# EasyEDA Pro project 嘉立创专业版_ProDocument_遥控器设计_2024-03-31.epro

# Schematic Schematic1

## Sheets
1 其他: Create Date: 2023-11-18; Page Name: 其他; Project Name: 遥控器设计; Schematic Name: Schematic1; Update Date: 2024-01-14; Company: 嘉立创EDA; Page Size: A4; Version: V1.0
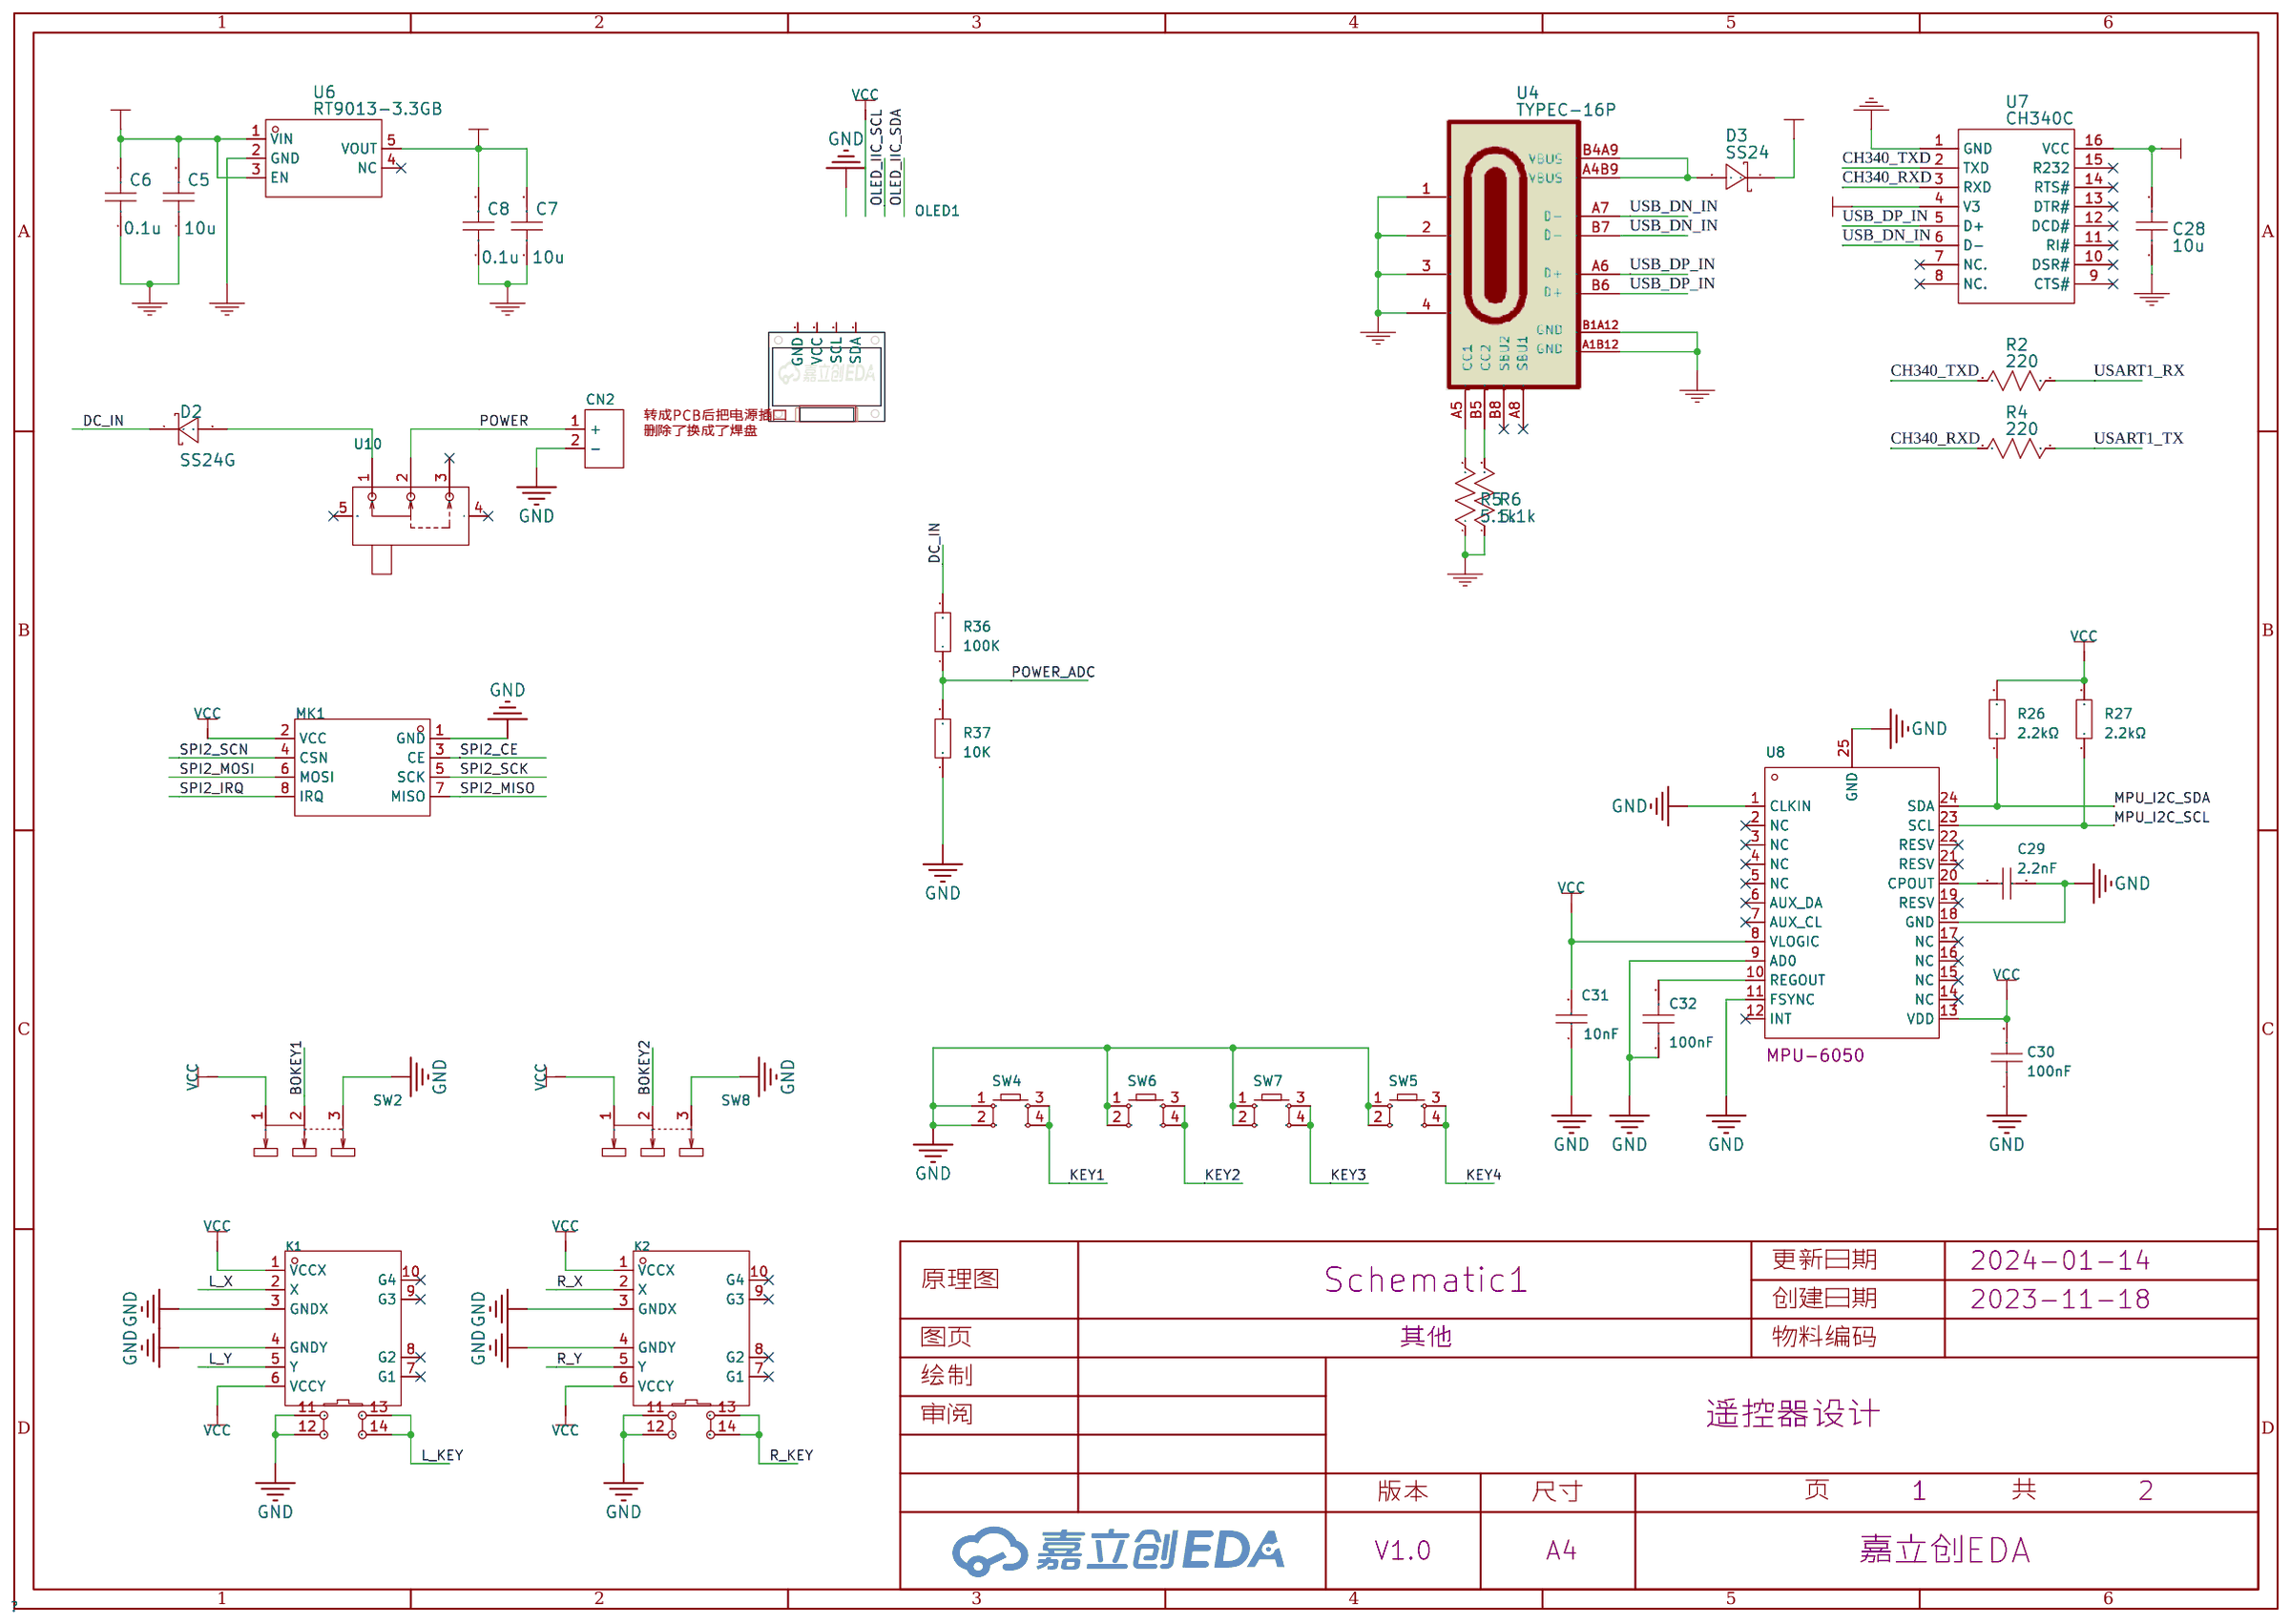
[diagram p0: 其他]
2 stm32最小系统: Page Name: stm32最小系统; Add into BOM: yes; Convert to PCB: yes
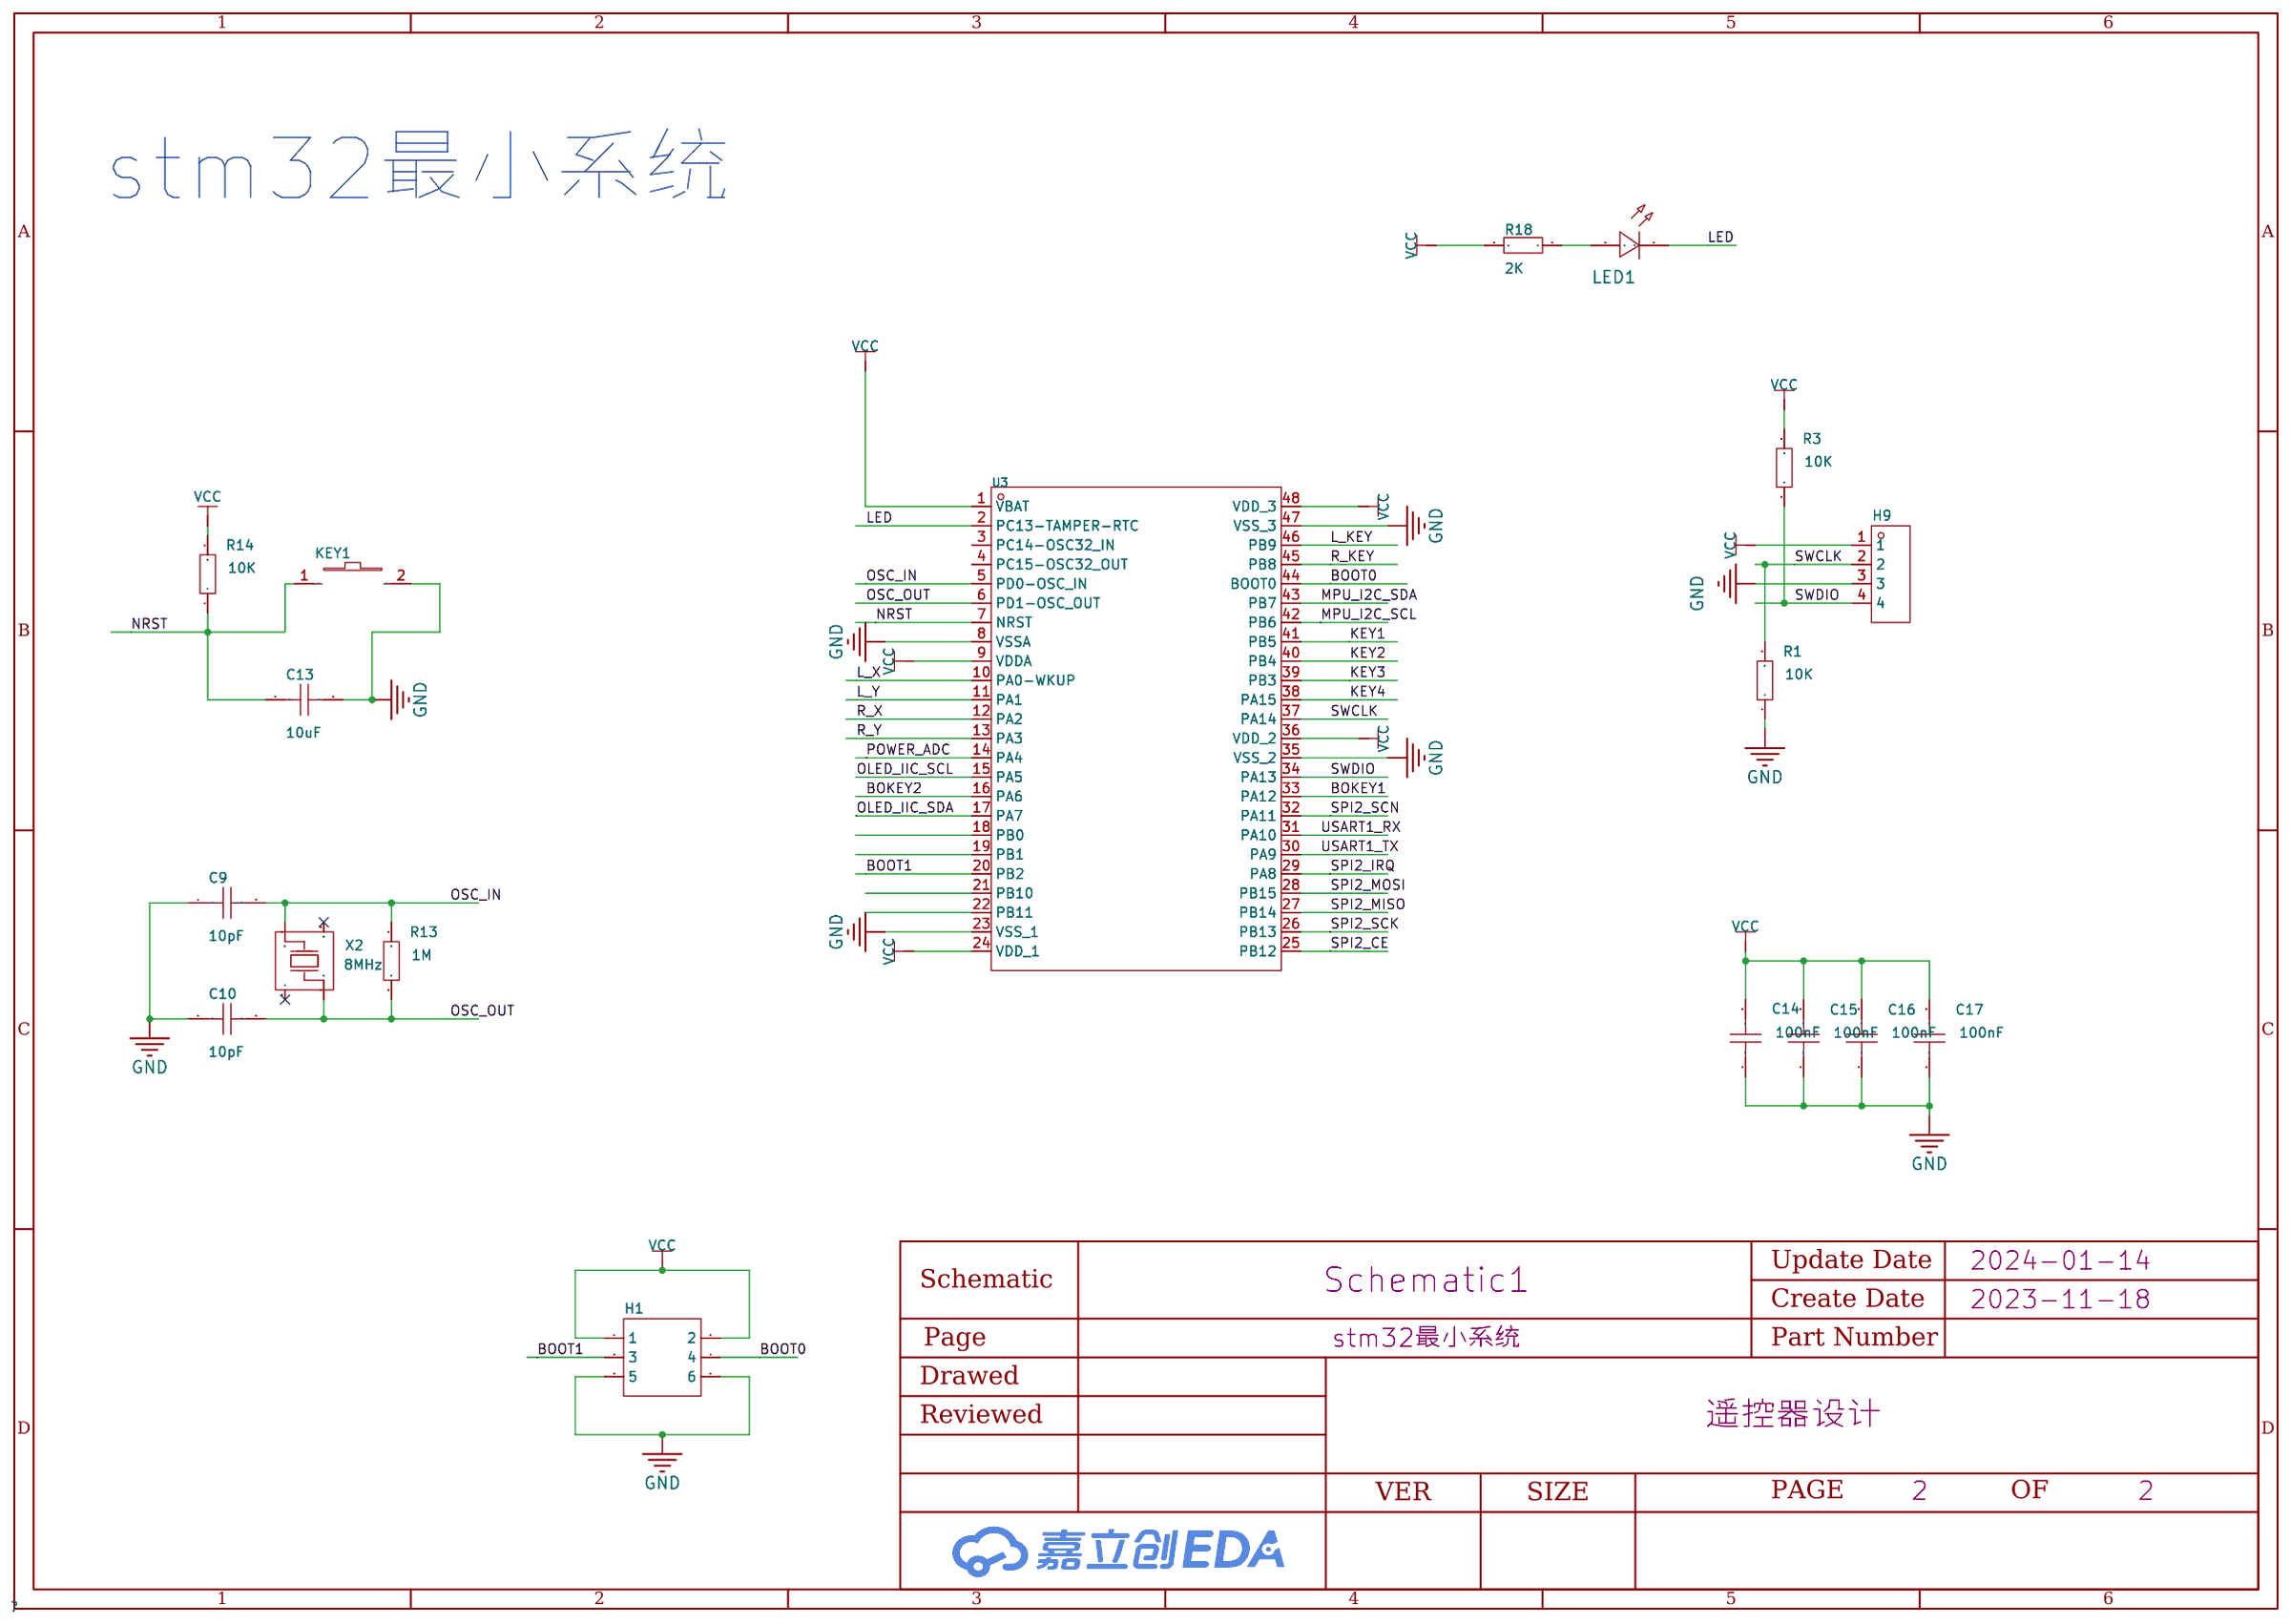
[diagram p1: stm32最小系统]

## Parts
sheet stm32最小系统
C9  10pF  [C0603]
C10  10pF  [C0603]
C13  10uF  [C0603]
C14  100nF  [C0603]
C15  100nF  [C0603]
C16  100nF  [C0603]
C17  100nF  [C0603]
H1  -  [HDR-TH_6P-P2.54-V-F-R2-C3-S2.54]
H9  -  [HDR-TH_4P-P2.54-V-M]
KEY1  轻触开关3x4x2  [SW-SMD_L4.0-W2.9-LS5.0]
LED1  -  [LED0805-RD_RED]
R1  10K  [R0603]
R3  10K  [R0603]
R13  1M  [R0603]
R14  10K  [R0603]
R18  2K  [R0603]
U3  STM32F103C8T6  [LQFP-48_L7.0-W7.0-P0.50-LS9.0-BL]
X2  8MHz  [OSC-SMD_4P-L3.2-W2.5-BL]
sheet 其他
C5  10u  [C0603]
C6  0.1u  [C0603]
C7  10u  [C0603]
C8  0.1u  [C0603]
C28  10u  [C0603]
C29  2.2nF  [C0603]
C30  100nF  [C0603]
C31  10nF  [C0603]
C32  100nF  [C0603]
CN2  XT30UPB-F  [CONN-TH_XT30UPB-F]
D2  SS24G  [SMA_L4.4-W2.8-LS5.4-RD]
D3  SS24  [SMA_L4.3-W2.6-LS5.2-RD]
K1  -  [摇杆按键-16x16-直插]
K2  -  [摇杆按键-16x16-直插]
MK1  NF-04  [WIRELM-SMD_NRF24L01]
OLED1  -  [0.96OLED_4P]
R2  220  [R0603]
R4  220  [R0603]
R5  5.1k  [R0603]
R6  5.1k  [R0603]
R26  2.2kΩ  [R0603]
R27  2.2kΩ  [R0603]
R36  100K  [R0603]
R37  10K  [R0603]
SW2  SS-12D10L5  [SW-TH_SS-12D10L5]
SW4  -  [SW-TH_4P-L6.0-W6.0-P4.50-LS6.5]
SW5  -  [SW-TH_4P-L6.0-W6.0-P4.50-LS6.5]
SW6  -  [SW-TH_4P-L6.0-W6.0-P4.50-LS6.5]
SW7  -  [SW-TH_4P-L6.0-W6.0-P4.50-LS6.5]
SW8  SS-12D10L5  [SW-TH_SS-12D10L5]
U4  TYPEC-16P  [TYPEC]
U6  RT9013-3.3GB  [SOT-23-5_L2.9-W1.6-P0.94-LS2.8-BL]
U7  CH340C  [SOP-16_L10.0-W3.9-P1.27-LS6.0-BL]
U8  -  [QFN-24_L4.0-W4.0-P0.50-BL-EP2.7]
U10  SS-12F23-G4  [SW-TH_SS-12F23-G040]

## Library data of the parts
C9 C10 = CAP_0603: Supplier Footprint: 0603
C13 = C0603: 容值:100nF;精度:±10%;额定电压:50V;材质(温度系数):X7R;; LCSC Part Name: 100nF ±10% 50V; Supplier Part: C14663; Manufacturer: YAGEO(国巨); Manufacturer Part: CC0603KRX7R9BB104; Supplier Footprint: 0603; JLCPCB Part Class: Basic Part; Datasheet: https://atta.szlcsc.com/upload/public/pdf/source/20170116/1484561234239.pdf; Supplier: LCSC; Tolerance: ±10%; Voltage Rated: 50V; Temperature Coefficient: X7R
C14-C17 = CAP_0805: Supplier Footprint: 0805
H1 = HDR-F_2.54_2x3: Supplier Part: C92272; Supplier Footprint: 插件
H9 = HDR-M_2.54_1x4P: Supplier Part: C492403; Supplier Footprint: 插件
KEY1 = 轻触开关3x4x2: 触点电流:50mA;额定电压(DC):12V;电路结构:单刀单掷;安装方式:立贴;按钮形状:圆形按钮;带灯:-;开关长度:4mm;开关宽度:3mm;开关高度:2mm;; LCSC Part Name: 3x4x2  柱高0.5; Supplier Part: C26638; Manufacturer: 国产; Supplier Footprint: SMD; JLCPCB Part Class: 扩展库; Datasheet: https://atta.szlcsc.com/upload/public/pdf/source/20150923/1457707412058.pdf; Supplier: LCSC; Contact Current: 50mA; Voltage Rating (DC): 12V; Circuit: 单刀单掷; Mounting Style: 立贴; Actuator Style: 圆形按钮; Switch Length: 4mm; Switch Width: 3mm; Switch Height: 2mm
LED1 = LED_0805-R: Supplier Footprint: 0805
R1 R3 R13 R14 R18 R36 R37 = Res_0603: Supplier Footprint: 0603
U3 = STM32F103C8T6: CPU内核:ARM Cortex-M3;CPU最大主频:72MHz;工作电压范围:2V~3.6V;内部振荡器:有;程序 FLASH容量:64K@x8bit;RAM总容量:20KB;EEPROM/数据 FLASH容量:-;GPIO端口数量:37;ADC(单元数/通道数/位数):1@x10ch/12bit;外设/功能/协议栈:看门狗；DMA；看门狗；片载温度传感器;工作温度范围:-40℃~+85℃;; LCSC Part Name: ARM Cortex-M3 72MHz 闪存：64K@x8bit RAM：20KB MSL=3; Supplier Part: C8734; Manufacturer: ST(意法半导体); Supplier Footprint: LQFP-48(7x7); JLCPCB Part Class: 扩展库; Supplier: LCSC; CPU Core: ARM Cortex-M3; Maximum Frequency: 72MHz; Supply Voltage Range: 2V~3.6V; Internal Oscillator: 有; Program FLASH Size: 64K@x8bit; RAM Size: 20KB; GPIO Ports Number: 37; ADC (Units/Channels/bits): 1@x10ch/12bit; Peripherals / Functions / Protocol Stacks: 看门狗；DMA；看门狗；片载温度传感器; Operating Temperature Range: -40℃~+85℃
X2 = TAXM8M4RDBCCT2T: 晶振类型:SMD 谐振器;频率:8MHz;频率公差:±10ppm;频率稳定度:±15ppm;负载电容:10pF;等效串联电阻(ESR):250Ω;工作温度:-;; LCSC Part Name: 8MHz ±10ppm 10pF; Supplier Part: C400090; Manufacturer: TAE(雅晶鑫); Supplier Footprint: SMD3225-4P; JLCPCB Part Class: 扩展库; Datasheet: https://atta.szlcsc.com/upload/public/pdf/source/20190626/C400090_CF95B89E745AFE4EF2E392EF8AC009D6.pdf; Supplier: LCSC; Crystal Type: SMD 谐振器; Frequency Tolerance: ±10ppm; Frequency Stability: ±15ppm; Load Capacitance: 10pF; Equivalent Series Resistance (ESR): 250Ω
C5 C7 C28 = 10u
C6 C8 = 0.1u
C29 = 0402B222K500NT: 容值:2.2nF;精度:±10%;额定电压:50V;材质(温度系数):X7R;; LCSC Part Name: 2.2nF ±10% 50V; Supplier Part: C1531; Manufacturer: FH(风华); Supplier Footprint: 0402; JLCPCB Part Class: 基础库; Datasheet: https://atta.szlcsc.com/upload/public/pdf/source/20170923/C1531_1506149258433988338.pdf; Supplier: LCSC; Tolerance: ±10%; Voltage Rated: 50V; Temperature Coefficient: X7R
C30 C32 = CC0402KRX7R7BB104: 容值:100nF;精度:±10%;额定电压:16V;材质(温度系数):X7R;; LCSC Part Name: 100nF ±10% 16V; Supplier Part: C60474; Manufacturer: YAGEO(国巨); Supplier Footprint: 0402; JLCPCB Part Class: 扩展库; Datasheet: https://atta.szlcsc.com/upload/public/pdf/source/20211223/9278FD768280B81DDBEF48FA36411A03.pdf; Supplier: LCSC; Tolerance: ±10%; Voltage Rated: 16V; Temperature Coefficient: X7R
C31 = CC0402KRX7R9BB103: 容值:10nF;精度:±10%;额定电压:50V;温度系数:X7R;; LCSC Part Name: 10nF ±10% 50V; Supplier Part: C60133; Manufacturer: YAGEO(国巨); Supplier Footprint: 0402; JLCPCB Part Class: Extended Part; Datasheet: https://atta.szlcsc.com/upload/public/pdf/source/20151201/1457707601869.pdf; Supplier: LCSC; Tolerance: ±10%; Voltage Rated: 50V; Temperature Coefficient: X7R
CN2 = XT30UPB-F: 模型插头连接器; Supplier Part: C108769; Manufacturer: AMASS(艾迈斯); Supplier Footprint: 间距5mm; JLCPCB Part Class: 扩展库; Datasheet: https://atta.szlcsc.com/upload/public/pdf/source/20180126/C108769_15169557890251308829.pdf; Supplier: LCSC
D2 = SS24G: Supplier: LCSC; Supplier Part: C183481; Manufacturer: SK; JLCPCB Part Class: Extended Part
D3 = SS24: Supplier: LCSC; Manufacturer: MDD; Supplier Part: C50645; JLCPCB Part Class: Extended Part
K1 K2 = 摇杆-按键-16x16-直插
MK1 = NRF24L01: 低成本NF-04台产芯片 功率加强版 最佳通讯距离240米，2.4G无线通讯模块; LCSC Part Name: NF-04 功率加强版 绑定 2.4G无线模块; Supplier Part: C90751; Manufacturer: Ai-Thinker(安信可); Supplier Footprint: 插件; JLCPCB Part Class: 扩展库; Datasheet: https://atta.szlcsc.com/upload/public/pdf/source/20190912/C90751_790912ADD510BE02DBCDD1D692AB4B0B.pdf; Supplier: LCSC
OLED1 = 0.96OLED模块_4P: Supplier Footprint: 插件
R2 R4 = 220
R5 R6 = 5.1k
R26 R27 = 0402WGF2201TCE: 电阻类型:厚膜电阻;阻值:2.2kΩ;精度:±1%;功率:62.5mW;温度系数:±100ppm/℃;最大工作电压:50V;工作温度范围:-55℃~+155℃;; LCSC Part Name: 2.2kΩ ±1% 62.5mW; Supplier Part: C25879; Manufacturer: UNI-ROYAL(厚声); Supplier Footprint: 0402; JLCPCB Part Class: 基础库; Datasheet: https://atta.szlcsc.com/upload/public/pdf/source/20200306/C422600_1E6D84923E4A46A82E41ADD87F860B5C.pdf; Supplier: LCSC; Type: 厚膜电阻; Tolerance: ±1%; Power(Watts): 62.5mW; Temperature Coefficient: ±100ppm/℃; Overload Voltage (Max): 50V; Operating Temperature Range: -55℃~+155℃
SW2 SW8 = SS-12D10L5: 额定电流(DC):3A;额定电压(DC):125V;额定电流(AC):3A;额定电压(AC):125V;电路结构:单刀双掷;安装方式:直插;机械寿命:1万次;开关颜色:黑色;; LCSC Part Name: 柄长5mm 直插双档 滑动开关 大电流; Supplier Part: C319012; Manufacturer: XKB Connectivity(中国星坤); Supplier Footprint: 插件; Datasheet: https://atta.szlcsc.com/upload/public/pdf/source/20211009/D6412F37AABE6F9459A6EE7FA4DAEADB.pdf; Supplier: LCSC; Current Rating (DC): 3A; Voltage Rating (DC): 125V; Current Rating (AC): 3A; Voltage Rating (AC): 125V; Circuit: 单刀双掷; Mounting Style: 直插; Mechanical Life: 1万次; Actuator Color: 黑色; Actuator Style: 矩形柱状; Pin Style: PC引脚; Operating Temperature: -40℃~+85℃; Switch Length: 13mm; Switch Width: 6.8mm; Switch Height: 6.4mm
SW4-SW7 = Key_TH_6x6x6: 触点电流:50mA;额定电压(DC):12V;绝缘电阻:100MΩ;电路结构:单刀单掷;安装方式:直插;按钮形状:圆形按钮;按钮/盖帽颜色:黑色;作用力:260gf@±30gf;工作温度:-25℃~+70℃;引脚样式:PC引脚;开关长度:6mm;开关宽度:6mm;开关高度:6mm;带支架:否;; Supplier Part: C2837516; Supplier Footprint: 插件
U4 = TYPEC-16P
U6 = RT9013-3.3GB: Supplier: LCSC; Supplier Part: C9900009203; Manufacturer: null; JLCPCB Part Class: Extended Part
U7 = CH340C: Supplier: LCSC; Manufacturer: WCH(南京沁恒); Supplier Part: C84681; JLCPCB Part Class: Extended Part
U8 = MPU-6050: 三轴加速度计和三轴陀螺仪，工作电压：2.375V~3.46V; Supplier Part: C24112; Manufacturer: TDK InvenSense(应美盛); Supplier Footprint: QFN-24_4x4x05P; JLCPCB Part Class: Basic Part; Datasheet: https://atta.szlcsc.com/upload/public/pdf/source/20140425/1457707046159.pdf; Supplier: LCSC
U10 = SS-12F23-G4: 电路结构:单刀双掷;安装方式:卧插;开关颜色:黑色;滑钮形状:矩形柱状;引脚样式:PC引脚;开关长度:13mm;开关宽度:5.8mm;开关高度:9mm;; LCSC Part Name: 拨动开关; Supplier Part: C2998806; Manufacturer: DEALON(德艺隆); Supplier Footprint: 插件; JLCPCB Part Class: 扩展库; Datasheet: https://atta.szlcsc.com/upload/public/pdf/source/20220428/B341684C4335C21BC408331FBC341DAE.pdf; Supplier: LCSC; Circuit: 单刀双掷; Mounting Style: 卧插; Actuator Color: 黑色; Actuator Style: 矩形柱状; Pin Style: PC引脚; Switch Length: 13mm; Switch Width: 5.8mm; Switch Height: 9mm

## Nets
GND: C5.1 C6.1 C7.1 C8.1 C9.1 C10.1 C13.2 C14.1 C15.1 C16.1 C17.1 C28.1 C29.2 C30.1 C31.1 C32.1 CN2.2(-) H1.5 H1.6 H9.3 K1.3(GNDX) K1.4(GNDY) K1.11(10) K1.12(11) K2.3(GNDX) K2.4(GNDY) K2.11(10) K2.12(11) KEY1.2 MK1.1(GND) R1.1 R5.1 R6.1 R37.1 SW2.3 SW4.1 SW4.2 SW5.1 SW5.2 SW6.1 SW6.2 SW7.1 SW7.2 SW8.3 U3.8(VSSA) U3.23(VSS_1) U3.35(VSS_2) U3.47(VSS_3) U4.1 U4.2(1) U4.3(1) U4.4(1) U4.A1B12(1) U4.B1A12(1) U6.2(GND) U7.1(GND) U8.1(CLKIN) U8.9(AD0) U8.11(FSYNC) U8.18(GND) U8.25(GND)
VCC: C7.2 C8.2 C14.2 C15.2 C16.2 C17.2 C28.2 C30.2 C31.2 H1.1 H1.2 H9.1 K1.1(VCCX) K1.6(VCCY) K2.1(VCCX) K2.6(VCCY) MK1.2(VCC) R3.2 R14.2 R18.2 R26.2 R27.2 SW2.1 SW8.1 U3.1(VBAT) U3.9(VDDA) U3.24(VDD_1) U3.36(VDD_2) U3.48(VDD_3) U6.5(VOUT) U7.4(V3) U7.16(VCC) U8.8(VLOGIC) U8.13(VDD)
BOKEY1: SW2.2 U3.33(PA12)
BOKEY2: SW8.2 U3.16(PA6)
BOOT0: H1.4 U3.44(BOOT0)
BOOT1: H1.3 U3.20(PB2)
CH340_RXD: R4.1 U7.3(RXD)
CH340_TXD: R2.1 U7.2(TXD)
DC_IN: C5.2 C6.2 D2.1 D3.1(K) R36.2 U6.1(VIN) U6.3(EN)
KEY1: SW4.3 SW4.4 U3.41(PB5)
KEY2: SW6.3 SW6.4 U3.40(PB4)
KEY3: SW7.3 SW7.4 U3.39(PB3)
KEY4: SW5.3 SW5.4 U3.38(PA15)
L_KEY: K1.13(12) K1.14(13) U3.46(PB9)
L_X: K1.2(X) U3.10(PA0-WKUP)
L_Y: K1.5(Y) U3.11(PA1)
LED: LED1.1(C) U3.2(PC13-TAMPER-RTC)
MPU_I2C_SCL: R27.1 U3.42(PB6) U8.23(SCL)
MPU_I2C_SDA: R26.1 U3.43(PB7) U8.24(SDA)
NRST: C13.1 KEY1.1 R14.1 U3.7(NRST)
OLED_IIC_SCL: U3.15(PA5)
OLED_IIC_SDA: U3.17(PA7)
OSC_IN: C9.2 R13.2 U3.5(PD0-OSC_IN) X2.3
OSC_OUT: C10.2 R13.1 U3.6(PD1-OSC_OUT) X2.1
POWER: CN2.1(+) U10.2
POWER_ADC: R36.1 R37.2 U3.14(PA4)
R_KEY: K2.13(12) K2.14(13) U3.45(PB8)
R_X: K2.2(X) U3.12(PA2)
R_Y: K2.5(Y) U3.13(PA3)
SPI2_CE: MK1.3(CE) U3.25(PB12)
SPI2_IRQ: MK1.8(IRQ) U3.29(PA8)
SPI2_MISO: MK1.7(MISO) U3.27(PB14)
SPI2_MOSI: MK1.6(MOSI) U3.28(PB15)
SPI2_SCK: MK1.5(SCK) U3.26(PB13)
SPI2_SCN: MK1.4(CSN) U3.32(PA11)
SWCLK: H9.2 R1.2 U3.37(PA14)
SWDIO: H9.4 R3.1 U3.34(PA13)
USART1_RX: R2.2 U3.31(PA10)
USART1_TX: R4.2 U3.30(PA9)
USB_DN_IN: U4.A7(1) U4.B7(1) U7.6(D-)
USB_DP_IN: U4.A6(1) U4.B6(1) U7.5(D+)
$1N1007: D3.2(A) U4.A4B9(1) U4.B4A9(1)
$1N1031: R5.2 U4.A5(1)
$1N1032: R6.2 U4.B5(1)
$1N1165: D2.2 U10.1
$1N1609: C29.1 U8.20(CPOUT)
$1N1611: C32.2 U8.10(REGOUT)
$4N10210: LED1.2(A) R18.1

Not connected (* = marked no-connect by the designer): K1 7(G1)* 8(G2)* 9(G3)* 10(G4)*; K2 7(G1)* 8(G2)* 9(G3)* 10(G4)*; OLED1 1(GND) 2(VCC) 3(SCL) 4(SDA); U3 3(PC14-OSC32_IN) 4(PC15-OSC32_OUT) 18(PB0) 19(PB1) 21(PB10) 22(PB11); U4 A8(1)* B8(1)*; U6 4(NC)*; U7 7(NC.)* 8(NC.)* 9(CTS#)* 10(DSR#)* 11(RI#)* 12(DCD#)* 13(DTR#)* 14(RTS#)* 15(R232)*; U8 2(NC)* 3(NC)* 4(NC)* 5(NC)* 6(AUX_DA)* 7(AUX_CL)* 12(INT)* 14(NC)* 15(NC)* 16(NC)* 17(NC)* 19(RESV)* 21(RESV)* 22(RESV)*; U10 3* 4* 5*; X2 2* 4*

## Notes on the sheets
sheet 1
- 转成PCB后把电源插口
  删除了换成了焊盘
sheet 2
- stm32最小系统

# Board PCB1
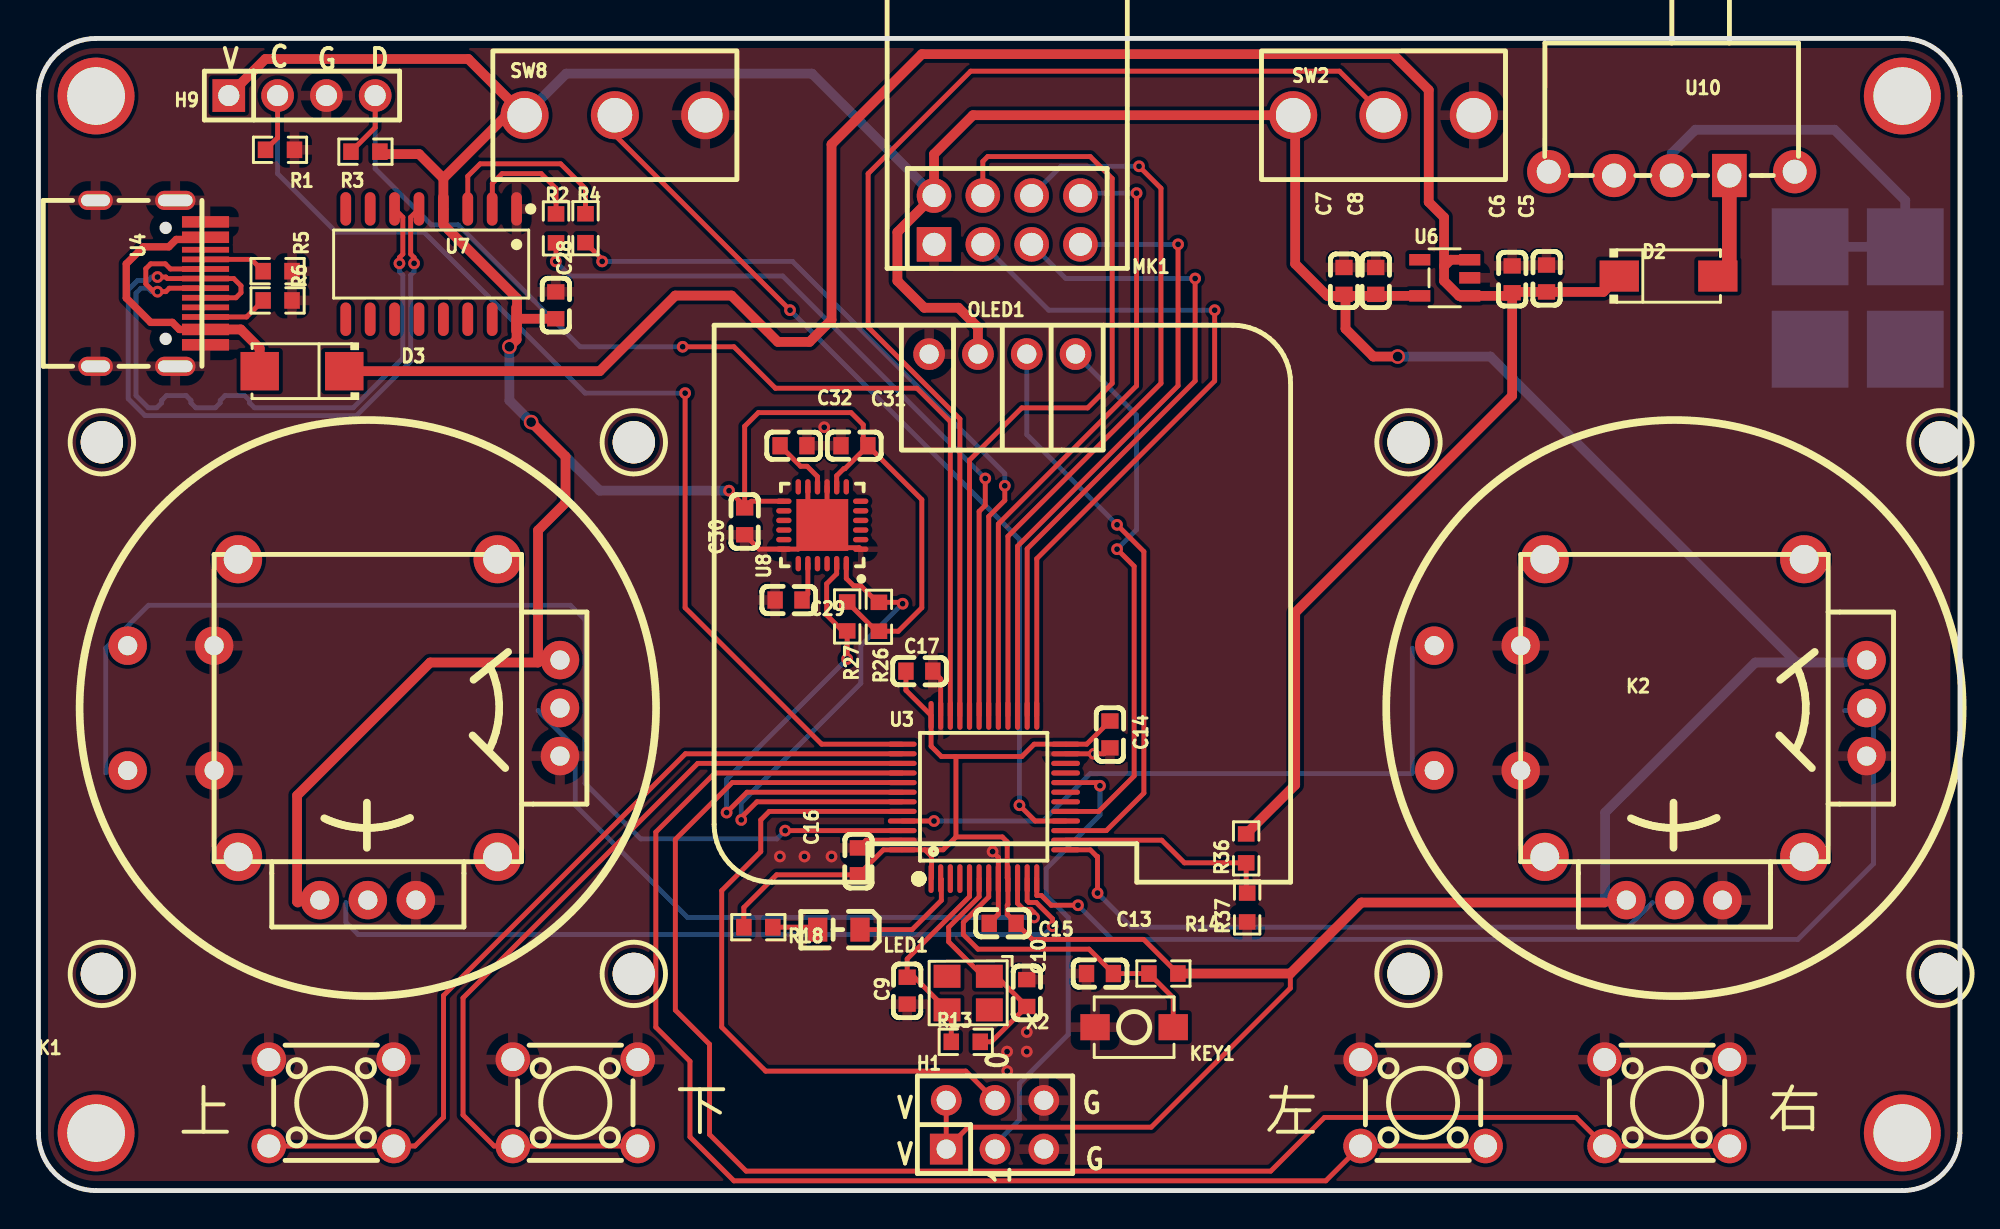
[diagram p2: board, top side]
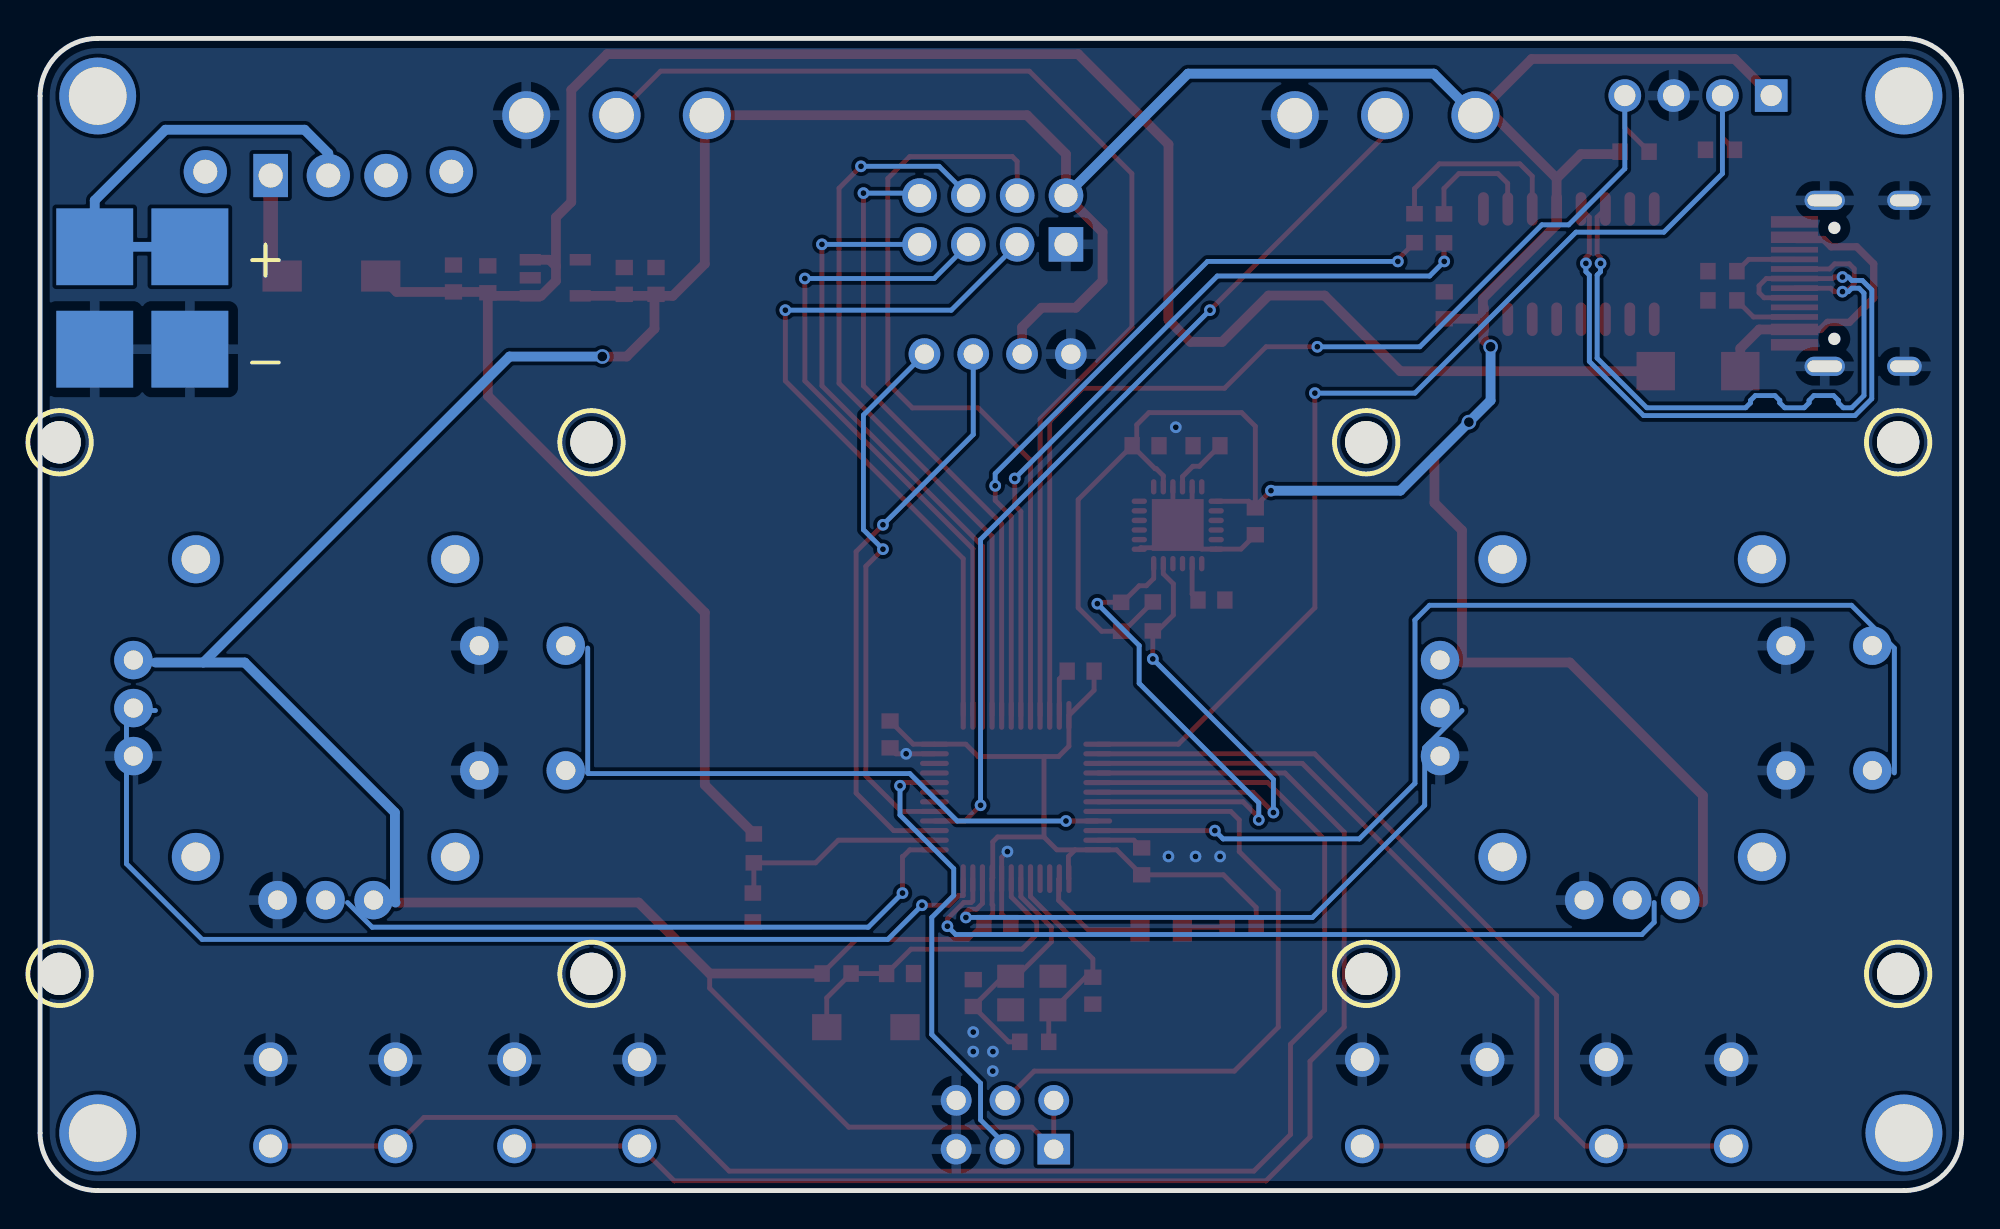
[diagram p3: board, bottom side, seen from below]

Outline 100 x 60 mm; copper layers: Top Layer, Bottom Layer. Coordinates in mm from the lower left corner of the outline.
Outline path: 0,57 0,3 arc(0.88,0.88) 3,0 97,0 arc(99.12,0.88) 100,3 100,57 arc(99.12,59.12) 97,60 3,60 arc(0.88,59.12) 0,57
Stack: Top Layer 0.035mm / Dielectric1 1.51mm FR4 er 4.5 / Bottom Layer 0.035mm

## Design rules (mm)
net USB_DP_IN: DP1
net USB_DN_IN: DP1
template: 自定义配置
spacing copperThickness1oz (default): track to track 0.102, other pairs 0.152 to 0.3
spacing copperThickness2oz: track to track 0.203, other pairs 0.152 to 0.3
track width copperThickness1oz (default): min 0.127, default 0.254, max 2.54
track width copperThickness2oz: min 0.203, default 0.254, max 2.54
differential pair differentialPair (default): width min 0.127, default 0.254, max 2.54; gap min 0.152, default 0.152
via viaSize (default): diameter min 0.5, default 0.61, max 10; hole min 0.3, default 0.305, max 6.3

## Placement (name value [footprint] x y rotation side)
C5  10u  [C0603]  78.49 47.5 270 top
C6  0.1u  [C0603]  76.7 47.45 270 top
C7  10u  [C0603]  67.94 47.37 270 top
C8  0.1u  [C0603]  69.6 47.37 270 top
C9  10pF  [C0603]  45.21 10.41 90 top
C10  10pF  [C0603]  51.44 10.29 270 top
C13  10uF  [C0603]  55.25 11.3 180 top
C14  100nF  [C0603]  55.76 23.75 90 top
C15  100nF  [C0603]  50.18 13.92 0 top
C16  100nF  [C0603]  42.67 17.14 270 top
C17  100nF  [C0603]  45.85 27.05 180 top
C28  10u  [C0603]  26.92 46.1 270 top
C29  2.2nF  [C0603]  39.04 30.75 180 top
C30  100nF  [C0603]  36.76 34.85 90 top
C31  10nF  [C0603]  42.47 38.79 0 top
C32  100nF  [C0603]  39.3 38.79 180 top
D2  SS24G  [SMA_L4.4-W2.8-LS5.4-RD]  84.84 47.62 0 top
D3  SS24  [SMA_L4.3-W2.6-LS5.2-RD]  13.72 42.67 180 top
H1  -  [HDR-TH_6P-P2.54-V-F-R2-C3-S2.54]  49.78 3.43 0 top
H9  -  [HDR-TH_4P-P2.54-V-M]  13.72 57.02 0 top
K1  -  [摇杆按键-16x16-直插]  16 25 0 top
K2  -  [摇杆按键-16x16-直插]  84 25 0 top
KEY1  轻触开关3x4x2  [SW-SMD_L4.0-W2.9-LS5.0]  57.02 8.51 180 top
LED1  -  [LED0805-RD_RED]  41.66 13.59 180 top
MK1  NF-04  [WIRELM-SMD_NRF24L01]  50.42 50.55 180 top
NOREF  -  [Pad_e1157]  92.2 43.81 180 top
NOREF#2  -  [Pad_e16]  97 3 0 top
NOREF#3  -  [Pad_e12]  3 3 0 top
NOREF#4  -  [Pad_e1153]  97.16 49.15 0 top
NOREF#5  -  [Pad_e1156]  92.2 49.15 180 top
NOREF#6  -  [Pad_e14]  3 57 0 top
NOREF#7  -  [Pad_e15]  97 57 0 top
NOREF#8  -  [Pad_e1155]  97.16 43.81 180 top
OLED1  -  [0.96OLED_4P]  50.16 43.56 0 top
R1  10K  [R0603]  12.57 54.2 180 top
R2  220  [R0603]  26.94 50.11 270 top
R3  10K  [R0603]  17.02 54.1 0 top
R4  220  [R0603]  28.47 50.12 270 top
R5  5.1k  [R0603]  12.45 47.88 180 top
R6  5.1k  [R0603]  12.45 46.36 180 top
R13  1M  [R0603]  48.26 7.75 180 top
R14  10K  [R0603]  58.55 11.3 0 top
R18  2K  [R0603]  37.47 13.72 180 top
R26  2.2kΩ  [R0603]  43.74 29.88 270 top
R27  2.2kΩ  [R0603]  42.09 29.9 90 top
R36  100K  [R0603]  62.85 17.82 90 top
R37  10K  [R0603]  62.91 14.74 90 top
SW2  SS-12D10L5  [SW-TH_SS-12D10L5]  70 56 0 top
SW4  -  [SW-TH_4P-L6.0-W6.0-P4.50-LS6.5]  84.76 4.57 0 top
SW5  -  [SW-TH_4P-L6.0-W6.0-P4.50-LS6.5]  15.24 4.57 0 top
SW6  -  [SW-TH_4P-L6.0-W6.0-P4.50-LS6.5]  72.06 4.57 0 top
SW7  -  [SW-TH_4P-L6.0-W6.0-P4.50-LS6.5]  27.94 4.57 0 top
SW8  SS-12D10L5  [SW-TH_SS-12D10L5]  30 56 0 top
U3  STM32F103C8T6  [LQFP-48_L7.0-W7.0-P0.50-LS9.0-BL]  49.21 20.5 0 top
U4  TYPEC-16P  [TYPEC]  5.33 47.24 270 top
U6  RT9013-3.3GB  [SOT-23-5_L2.9-W1.6-P0.94-LS2.8-BL]  73.19 47.53 90 top
U7  CH340C  [SOP-16_L10.0-W3.9-P1.27-LS6.0-BL]  20.44 48.25 180 top
U8  -  [QFN-24_L4.0-W4.0-P0.50-BL-EP2.7]  40.79 34.65 90 top
U10  SS-12F23-G4  [SW-TH_SS-12F23-G040]  85 52.96 180 top
X2  8MHz  [OSC-SMD_4P-L3.2-W2.5-BL]  48.39 10.29 180 top

## Footprints (pads in the part's own frame, mm; a bottom-side part is the same pattern mirrored in y, then rotated)
0.96OLED_4P
  round 1.65 hole 1: 1(-3.81,-0.002) 2(-1.27,0.002) 3(1.27,0.002) 4(3.81,0.002)
C0603
  rect 0.8x0.9 smd: 1(-0.7,0) 2(0.7,0)
HDR-TH_4P-P2.54-V-M
  rect 1.7x1.7 hole 1.1: 1(-3.81,0)
  round 1.7 hole 1.1: 2(-1.27,0) 3(1.27,0) 4(3.81,0)
HDR-TH_6P-P2.54-V-F-R2-C3-S2.54
  rect 1.7x1.6 hole 1: 1(-2.54,-1.27)
  round 1.6 hole 1: 2(-2.54,1.27) 3(0,-1.27) 4(0,1.27) 5(2.54,-1.27) 6(2.54,1.27)
LED0805-RD_RED
  rect 1x1.25 smd: 1(-1.1,0) 2(1.1,0)
LQFP-48_L7.0-W7.0-P0.50-LS9.0-BL
  oval 0.27x1.5 smd: 1(-2.75,-4.25) 2(-2.25,-4.25) 3(-1.75,-4.25) 4(-1.25,-4.25) 5(-0.75,-4.25) 6(-0.25,-4.25) 7(0.25,-4.25) 8(0.75,-4.25) 9(1.25,-4.25) 10(1.75,-4.25) 11(2.25,-4.25) 12(2.75,-4.25) 25(2.75,4.25) 26(2.25,4.25) 27(1.75,4.25) 28(1.25,4.25) 29(0.75,4.25) 30(0.25,4.25) 31(-0.25,4.25) 32(-0.75,4.25) 33(-1.25,4.25) 34(-1.75,4.25) 35(-2.25,4.25) 36(-2.75,4.25)
  oval 1.5x0.27 smd: 13(4.25,-2.75) 14(4.25,-2.25) 15(4.25,-1.75) 16(4.25,-1.25) 17(4.25,-0.75) 18(4.25,-0.25) 19(4.25,0.25) 20(4.25,0.75) 21(4.25,1.25) 22(4.25,1.75) 23(4.25,2.25) 24(4.25,2.75) 37(-4.25,2.75) 38(-4.25,2.25) 39(-4.25,1.75) 40(-4.25,1.25) 41(-4.25,0.75) 42(-4.25,0.25) 43(-4.25,-0.25) 44(-4.25,-0.75) 45(-4.25,-1.25) 46(-4.25,-1.75) 47(-4.25,-2.25) 48(-4.25,-2.75)
OSC-SMD_4P-L3.2-W2.5-BL
  rect 1.4x1.2 smd: 1(-1.1,-0.875) 2(1.1,-0.875) 3(1.1,0.875) 4(-1.1,0.875)
Pad_e12
  round 4 hole 3: 65(0,0)
Pad_e14
  round 4 hole 3: 65(0,0)
Pad_e15
  round 4 hole 3: 65(0,0)
Pad_e16
  round 4 hole 3: 65(0,0)
Pad_e1153
  rect 4x4 smd far side: 49(0,0)
Pad_e1155
  rect 4x4 smd far side: 49(0,0)
Pad_e1156
  rect 4x4 smd far side: 49(0,0)
Pad_e1157
  rect 4x4 smd far side: 49(0,0)
QFN-24_L4.0-W4.0-P0.50-BL-EP2.7
  oval 0.28x0.8 smd: 1(-1.25,-2) 2(-0.75,-2) 3(-0.25,-2) 4(0.25,-2) 5(0.75,-2) 6(1.25,-2) 13(1.25,2) 14(0.75,2) 15(0.25,2) 16(-0.25,2) 17(-0.75,2) 18(-1.242,2)
  oval 0.8x0.28 smd: 7(2,-1.25) 8(2,-0.75) 9(2,-0.25) 10(2,0.25) 11(2,0.75) 12(2,1.25) 19(-2,1.25) 20(-2,0.75) 21(-2,0.25) 22(-2,-0.25) 23(-2,-0.75) 24(-2,-1.25)
  rect 2.7x2.7 smd: 25(0.013,0)
R0603
  rect 0.806x0.864 smd: 1(-0.753,0) 2(0.753,0)
SMA_L4.3-W2.6-LS5.2-RD
  rect 2x2 smd: 1(-2.2,0) 2(2.2,0)
SMA_L4.4-W2.8-LS5.4-RD
  rect 2.046x1.62 smd: 1(-2.566,0) 2(2.566,0)
SOP-16_L10.0-W3.9-P1.27-LS6.0-BL
  oval 0.56x1.745 smd: 1(-4.445,-2.873) 2(-3.175,-2.873) 3(-1.905,-2.873) 4(-0.635,-2.873) 5(0.635,-2.873) 6(1.905,-2.873) 7(3.175,-2.873) 8(4.445,-2.873) 9(4.445,2.873) 10(3.175,2.873) 11(1.905,2.873) 12(0.635,2.873) 13(-0.635,2.873) 14(-1.905,2.873) 15(-3.175,2.873) 16(-4.445,2.873)
SOT-23-5_L2.9-W1.6-P0.94-LS2.8-BL
  rect 0.6x1.1 smd: 1(-0.94,-1.3) 2(0,-1.3) 3(0.94,-1.3) 4(0.94,1.3) 5(-0.94,1.3)
SW-SMD_L4.0-W2.9-LS5.0
  rect 1.53x1.36 smd: 1(-2.035,0) 2(2.035,0)
SW-TH_4P-L6.0-W6.0-P4.50-LS6.5
  round 1.8 hole 1.2: 1(-3.25,2.25) 2(3.25,2.25) 3(-3.25,-2.25) 4(3.25,-2.25)
SW-TH_SS-12D10L5
  round 2.5 hole 1.8: 1(-4.7,0) 2(0,0) 3(4.7,0)
SW-TH_SS-12F23-G040
  rect 1.801x2.251 hole 1.25: 1(-2.999,0.099)
  round 2.251 hole 1.25: 2(0,0.099) 3(2.999,0.099) 4(6.401,-0.099) 5(-6.401,-0.099)
TYPEC
  oval 1x2.1 hole 0.61x1.8: 1(-4.32,1.788) 2(4.32,1.788)
  oval 1x1.8 hole 0.61x1.5: 3(-4.32,-2.362) 4(4.32,-2.362)
  rect 0.6x2.45 smd: A1B12(-3.2,3.362) A4B9(-2.4,3.362) B1A12(3.2,3.362) B4A9(2.4,3.362)
  rect 0.3x2.45 smd: A5(-1.25,3.362) A6(-0.25,3.362) A7(0.25,3.362) A8(-1.75,3.362) B5(1.75,3.362) B6(0.75,3.362) B7(-0.75,3.362) B8(1.25,3.362)
WIRELM-SMD_NRF24L01
  rect 1.8x1.8 hole 1.2: 1(3.808,1.27)
  round 1.8 hole 1.2: 2(3.81,-1.27) 3(1.27,1.27) 4(1.27,-1.27) 5(-1.27,1.27) 6(-1.27,-1.27) 7(-3.81,1.27) 8(-3.81,-1.27)
摇杆按键-16x16-直插
  round 2.2 hole 2.2: 1(-12.699,13.969) 1(-12.699,-13.715) 1(14.985,13.969) 1(14.985,-13.715)
  round 2 hole 1: 1(11.143,2.627) 2(11.143,0.127) 3(11.143,-2.373) 4(3.643,-9.873) 5(1.143,-9.873) 6(-1.357,-9.873) 11(-6.857,3.377) 12(-6.857,-3.123) 13(-11.357,3.377) 14(-11.357,-3.123)
  round 2.5 hole 1.5: 7(7.893,7.877) 8(7.893,-7.623) 9(-5.607,-7.623) 10(-5.607,7.877)

## Nets
As in the schematic, except:
GND: C5.1 C6.1 C7.1 C8.1 C9.1 C10.1 C13.2 C14.1 C15.1 C16.1 C17.1 C28.1 C29.2 C30.1 C31.1 C32.1 H1.5 H1.6 H9.3 K1.3 K1.4 K1.11 K1.12 K2.3 K2.4 K2.11 K2.12 KEY1.2 MK1.1 NOREF.49 NOREF#8.49 OLED1.1 R1.1 R5.1 R6.1 R37.1 SW2.3 SW4.1 SW4.2 SW5.1 SW5.2 SW6.1 SW6.2 SW7.1 SW7.2 SW8.3 U3.8 U3.23 U3.35 U3.47 U4.1 U4.2 U4.3 U4.4 U4.A1B12 U4.B1A12 U6.2 U7.1 U8.1 U8.9 U8.11 U8.18 U8.25
VCC: C7.2 C8.2 C14.2 C15.2 C16.2 C17.2 C28.2 C30.2 C31.2 H1.1 H1.2 H9.1 K1.6 K2.6 MK1.2 OLED1.2 R3.2 R14.2 R18.2 R26.2 R27.2 SW2.1 SW8.1 U3.1 U3.9 U3.24 U3.36 U3.48 U6.5 U7.4 U7.16 U8.8 U8.13
OLED_IIC_SCL: OLED1.3 U3.15
OLED_IIC_SDA: OLED1.4 U3.17
POWER: NOREF#4.49 NOREF#5.49 U10.2

Pads without a net: K1 1 7 8 9 10; K2 1 7 8 9 10; NOREF#2 65; NOREF#3 65; NOREF#6 65; NOREF#7 65; U3 3 4; U4 A8 B8; U6 4; U7 7 8 9 10 11 12 13 14 15; U8 2 3 4 5 6 7 12 14 15 16 17 19 21 22; U10 3 4 5; X2 2 4

## Via types
v1: diameter 0.61, hole 0.305, Top Layer to Bottom Layer, 41 vias
v2: diameter 0.762, hole 0.508, Top Layer to Bottom Layer, 3 vias

## Routing (per net, layer and track width the routed paths; a pad name or vN(x,y) marks a point on that pad's centre or on a via; arc(x,y) is an arc through that point)
GND: length 23.2
  Top Layer w0.254: U3.23 v1(54.93,22.75) 55.46,22.75 C14.1 ; v1(49.66,17.65) 49.96,17.35 U3.8 49.96,14.39 C15.1 ; U8.25 40.04,35.41 U8.11 ; U8.25 39.54,33.41 U8.18 37.5,33.41 C30.1 ; U8.25 41.04,34.91 U8.9 ; U8.25 41.97,33.48 42.71,33.48 U8.1 ; C17.1 46.96,26.64 U3.35 ; U3.47 43.07,18.25 C16.1
  vias: v1(38.59,17.4) v1(39.87,17.4) v1(40.89,39.75) v1(41.28,17.4) v1(50.41,7.24) v1(50.42,6.22) v1(51.44,8.25) v1(51.44,7.24)
VCC: length 348.9
  Top Layer w0.254: C17.2 45.15,26.06 U3.36 46.46,23.14 46.99,22.61 47.72,22.61 ; 36.76,35.63 C30.2 37.1,35.9 U8.13 ; 36.76,35.63 36.76,39.8 37.47,40.51 42.29,40.51 42.93,39.88 42.93,39.03 C31.2 ; 36.76,35.63 v1(35.94,36.45) ; C31.2 41.97,37.59 41.91,37.59 41.54,37.23 U8.8 ; C31.2 45.97,35.98 45.97,30.35 44.75,29.13 R26.2 43.61,29.13 R27.2 ; 47.75,18.42 50.16,18.42 50.42,18.16 50.42,16.28 U3.9 50.46,14.9 50.42,14.86 50.42,14.38 C15.2 51.72,13.08 57.52,13.08 R14.2 ; 47.75,18.42 47.08,17.75 46.13,17.75 ; 47.75,18.42 47.75,22.57 47.72,22.61 ; 47.72,22.61 51.18,22.61 51.82,23.25 U3.24 54.56,23.25 C14.2 ; U3.1 46.48,16.27 46.48,17.4 46.13,17.75 ; 46.13,17.75 U3.48 43.97,17.75 C16.2 38.42,16.44 36.71,14.74 R18.2 ; H1.2 H1.1 48.39,3.3 57.91,3.3 65.15,10.54 65.15,11.3
  Top Layer w0.508: 21.07,52.71 U7.4 21.07,50.3 24.91,46.47 24.91,45.4 ; 21.07,52.71 19.81,53.97 17.9,53.97 R3.2 ; 21.07,52.71 24.36,56 SW8.1 22.37,58.93 11.81,58.93 H9.1 ; v2(24.51,43.94) 24.88,44.31 U7.16 24.91,45.4 ; 68.02,46.59 67.07,46.59 65.41,48.26 65.41,55.89 SW2.1 48.63,56 46.61,53.97 MK1.2 44.7,49.91 44.7,47.37 46.1,45.97 47.88,45.97 48.9,44.96 48.9,43.56 ; 68.02,46.59 68.02,44.88 69.47,43.43 v2(70.74,43.43) ; 68.02,46.59 67.94,46.67 ; 68.02,46.59 U6.5 ; C28.2 24.91,45.4 ; 25.65,40 27.43,38.23 27.43,35.81 26,34.38 26,27.5 20.39,27.5 13.46,20.57 13.46,15.04 13.5,15 ; R14.2 65.15,11.3 68.85,15 81.5,15
  Bottom Layer w0.508: 91.5,27.5 89.35,27.5 81.53,19.69 81.53,15.03 81.5,15 ; 91.5,27.5 94,27.5 ; 91.5,27.5 75.56,43.43 v2(70.74,43.43) ; SW8.1 27.47,58.17 40.26,58.17 MK1.2 ; v2(24.51,43.94) 24.51,41.15 v2(25.64,40.02) 29.21,36.45 v1(35.94,36.45)
BOKEY1: length 60.2
  Top Layer w0.254: U3.33 47.96,40.18 43.18,44.96 43.18,52.96 48.51,58.29 67.71,58.29 SW2.2
BOKEY2: length 47.5
  Top Layer w0.254: SW8.2 30,54.96 v1(39.12,45.85) ; U3.16 51.87,19.25 v1(51.05,20.07)
  Bottom Layer w0.254: v1(51.05,20.07) 51.05,33.91 v1(39.12,45.85) 38.99,45.85
BOOT0: length 35
  Top Layer w0.254: H1.4 48.26,6.22 37.85,6.22 35.56,8.51 35.56,15.62 37.59,17.65 37.59,19.3 38.03,19.75 U3.44
BOOT1: length 24
  Top Layer w0.254: U3.20 55.08,21.25 v1(55.25,21.08)
  Bottom Layer w0.254: H1.3 49.78,2.41 51.05,3.68 51.05,5.59 53.59,8.13 53.59,14.22 52.45,15.37 52.45,16.76 55.25,19.56 v1(55.25,21.08)
CH340_RXD: length 9.9
  Top Layer w0.254: U7.3 22.34,52.82 22.99,53.47 27.18,53.47 28.47,52.18 R4.1
CH340_TXD: length 6.5
  Top Layer w0.254: R2.1 26.94,52.18 26.16,52.96 24.13,52.96 23.62,52.45 23.62,51.13 U7.2
DC_IN: length 126.9
  Top Layer w0.508: 73.15,48.13 73.49,48.47 U6.3 ; 73.15,48.13 73.15,47.37 73.93,46.59 U6.1 76.54,46.59 C6.2 ; 73.15,48.13 73.15,50.68 72.35,51.48 72.35,57.31 70.49,59.18 45.97,59.18 41.28,54.48 41.28,45.34 40.13,44.2 38.48,44.2 36.07,46.61 33.15,46.61 29.21,42.67 D3.1 ; C6.2 76.74,46.8 C5.2 81.44,46.8 D2.1 ; C6.2 76.7,41.39 65.41,30.1 65.41,21.12 R36.2
KEY1: length 84.8
  Top Layer w0.254: SW4.4 SW4.3 80.02,3.81 66.93,3.81 64.13,1.02 36.83,1.02 34.93,2.92 34.93,7.62 33.15,9.4 33.15,18.29 36.11,21.25 U3.41
KEY2: length 73.8
  Top Layer w0.254: SW6.4 SW6.3 67,0.51 36.19,0.51 33.91,2.79 33.91,6.73 32.13,8.51 32.13,18.67 35.21,21.75 U3.40
KEY3: length 43.8
  Top Layer w0.254: U3.39 34.31,22.25 22.1,10.03 22.1,3.94 23.71,2.32 SW7.3 SW7.4
KEY4: length 45.1
  Top Layer w0.254: U3.38 33.67,22.75 21.08,10.16 21.08,3.81 19.59,2.32 SW5.4 SW5.3
L_KEY: length 59.1
  Top Layer w0.254: U3.46 v1(38.86,18.75)
  Bottom Layer w0.254: v1(38.86,18.75) 38.43,18.31 31.34,18.31 28.45,21.21 28.45,29.72 27.69,30.48 5.73,30.48 3.5,28.25 3.5,21.75
L_X: length 34.6
  Top Layer w0.254: v1(51.82,14.22) 51.82,14.48 51.65,14.65 51.27,14.65 50.96,14.96 U3.10
  Bottom Layer w0.254: v1(51.82,14.22) 33.78,14.22 27.94,20.07 27.94,23.06 26,25
L_Y: length 41.5
  Top Layer w0.254: U3.11 51.46,15.09 51.54,15 51.93,15 52.78,14.15 v1(52.78,13.77)
  Bottom Layer w0.254: 16,15 16,13.97 16.64,13.33 52.35,13.33 v1(52.78,13.77)
LED: length 6
  Top Layer w0.254: U3.2 46.99,16.21 46.99,15.11 45.47,13.59 LED1.1
MPU_I2C_SCL: length 25.9
  Top Layer w0.254: U3.42 36.88,20.75 v1(35.81,19.69) ; v1(42.09,27.69) R27.1 41.85,29.14 41.02,29.97 41.02,31.6 41.54,32.12 U8.23
  Bottom Layer w0.254: v1(35.81,19.69) 35.81,21.41 v1(42.09,27.69)
MPU_I2C_SDA: length 27.8
  Top Layer w0.254: U8.24 42.04,31.88 42.42,31.5 42.8,31.5 43.66,30.63 R26.1 44.96,30.63 ; U3.43 37.39,20.25 36.58,19.43 v1(36.58,19.3)
  Bottom Layer w0.254: v1(36.58,19.3) 36.58,20.19 42.8,26.42 42.8,28.39 v1(44.98,30.56)
NRST: length 17.3
  Top Layer w0.254: U3.7 49.46,15.29 48.13,13.97 48.13,13.33 48.9,12.57 54.68,12.57 C13.1 R14.1 59.06,10.04 KEY1.1
OLED_IIC_SCL: length 30.3
  Top Layer w0.254: v1(56.13,34.67) 57.53,33.27 57.53,20.7 55.58,18.75 U3.15
  Bottom Layer w0.254: v1(56.13,34.67) 51.44,39.37 OLED1.3
OLED_IIC_SDA: length 28.4
  Top Layer w0.254: U3.17 55.18,19.75 57.02,21.59 57.02,32.51 v1(56.13,33.4)
  Bottom Layer w0.254: v1(56.13,33.4) 57.15,34.42 57.15,40.39 OLED1.4
OSC_IN: length 11
  Top Layer w0.254: R13.2 47.51,9.19 X2.3 45.59,11.11 C9.2 45.21,12.06 48.46,15.31 U3.5
OSC_OUT: length 12.6
  Top Layer w0.254: U3.6 48.96,15.3 47.37,13.72 47.37,12.95 49.16,11.16 X2.1 49.86,11.16 51.44,9.59 49.59,7.75 R13.1
POWER: length 22.7
  Bottom Layer w0.508: NOREF#5.49 NOREF#4.49 97.16,51.56 93.47,55.25 86.23,55.25 85,54.01 U10.2
POWER_ADC: length 11.5
  Top Layer w0.254: U3.14 58.46,18.25 59.64,17.07 R36.1 62.85,15.55 R37.2
R_KEY: length 34.1
  Top Layer w0.254: U3.45 v1(46.61,19.25)
  Bottom Layer w0.254: v1(46.61,19.25) 52.27,19.25 54.74,21.72 71.47,21.72 71.5,21.75 71.5,28.25
R_X: length 56.2
  Top Layer w0.254: U3.12 51.96,15.37 52.2,15.37 52.71,14.86 v1(54.1,14.86)
  Bottom Layer w0.254: 94,25 95.01,25 95.5,24.51 95.5,17.02 91.57,13.08 55.88,13.08 v1(54.1,14.86)
R_Y: length 33.9
  Top Layer w0.254: U3.13 54.74,17.75 55.08,17.4 55.12,17.4 v1(55.12,15.49)
  Bottom Layer w0.254: v1(55.12,15.49) 56.9,13.72 82.72,13.72 84,15
SPI2_CE: length 38.4
  Top Layer w0.254: U3.25 51.96,32.91 61.21,42.16 v1(61.21,45.85)
  Bottom Layer w0.254: MK1.3 52.58,45.85 v1(61.21,45.85)
SPI2_IRQ: length 33.2
  Top Layer w0.254: v1(57.15,51.94) 57.15,41.91 49.96,34.72 U3.29
  Bottom Layer w0.254: MK1.8 54.36,51.94 v1(57.15,51.94)
SPI2_MISO: length 33.1
  Top Layer w0.254: v1(59.31,49.28) 59.31,41.91 50.96,33.56 U3.27
  Bottom Layer w0.254: v1(59.31,49.28) MK1.7
SPI2_MOSI: length 38.6
  Top Layer w0.254: U3.28 50.46,34.07 58.42,42.04 58.42,52.2 v1(57.28,53.34)
  Bottom Layer w0.254: 51.69,51.82 53.21,53.34 v1(57.28,53.34)
SPI2_SCK: length 35.6
  Top Layer w0.254: U3.26 51.46,33.42 60.2,42.16 v1(60.2,47.5)
  Bottom Layer w0.254: v1(60.2,47.5) 53.47,47.5 51.69,49.28
SPI2_SCN: length 42.1
  Top Layer w0.254: MK1.4 49.15,53.59 49.4,53.85 54.74,53.85 55.88,52.7 55.88,42.04 54.6,40.76 51.17,40.76 48.46,38.04 U3.32
SWCLK: length 58.5
  Top Layer w0.254: v1(33.66,41.53) 33.66,30.35 40.76,23.25 U3.37 ; R1.2 12.45,54.83 H9.2
  Bottom Layer w0.254: H9.2 12.45,52.96 15.49,49.91 20.07,49.91 28.45,41.53 v1(33.66,41.53)
SWDIO: length 57.9
  Top Layer w0.254: v1(33.53,43.94) 36.19,43.94 38.35,41.78 45.72,41.78 47.46,40.05 U3.34 ; H9.4 17.53,55.36 R3.1
  Bottom Layer w0.254: v1(33.53,43.94) 28.19,43.94 21.84,50.29 20.45,50.29 17.53,53.21 H9.4
USART1_RX: length 40.5
  Top Layer w0.254: U3.31 48.96,35.37 49.28,35.69 v1(49.28,37.08) ; v1(26.92,48.39) 26.94,48.4 R2.2
  Bottom Layer w0.254: v1(49.28,37.08) 38.74,47.62 27.69,47.62 v1(26.92,48.39)
USART1_TX: length 39.8
  Top Layer w0.254: U3.30 49.46,35.11 50.29,35.94 v1(50.29,36.7) ; R4.2 29.34,48.5 v1(29.34,48.39)
  Bottom Layer w0.254: v1(50.29,36.7) 50.29,37.34 39.24,48.39 v1(29.34,48.39)
USB_DN_IN: length 38.8
  Top Layer w0.254: U4.B7 6.87,47.99 6.6,48.26 5.84,48.26 5.59,48.01 5.59,47.22 6,46.81 v1(6.2,46.81) 6.63,46.81 6.81,46.99 8.69,46.99 ; U7.6 18.97,50.69 18.97,48.77 18.79,48.59 v1(18.79,48.28)
  Bottom Layer w0.254: v1(6.2,46.81) 5.89,46.81 5.72,46.99 5.33,46.99 5.08,46.74 5.08,41.4 5.72,40.77 6.16,40.77 6.41,41.02 6.41,41.15 6.67,41.4 7.68,41.4 7.94,41.15 7.94,41.02 8.19,40.77 9.21,40.77 9.46,41.02 9.46,41.15 9.71,41.4 10.73,41.4 10.98,41.15 10.98,41.02 11.24,40.77 16.38,40.77 18.97,43.35 18.97,47.68 18.79,47.85 v1(18.79,48.28)
USB_DP_IN: length 38.8
  Top Layer w0.254: v1(19.55,48.28) 19.55,48.59 19.37,48.77 19.37,50.69 U7.5 ; U4.B6 10.28,46.49 10.54,46.76 10.54,47.12 10.16,47.49 U4.A6 6.71,47.49 6.63,47.57 v1(6.2,47.57)
  Bottom Layer w0.254: v1(6.2,47.57) 5.89,47.57 5.72,47.4 5.17,47.4 4.67,46.9 4.67,41.23 5.55,40.36 16.55,40.36 19.37,43.18 19.37,47.68 19.55,47.85 v1(19.55,48.28)
$1N1007: length 15.7
  Top Layer w0.381: 7.17,49.53 6.79,49.15 5.46,49.15 4.57,48.26 4.57,46.48 5.84,45.21 6.97,45.21 7.34,44.84 U4.B4A9 ; 7.17,49.53 8.58,49.53 U4.A4B9
  Top Layer w0.508: D3.2 11.52,43.86 10.53,44.84 U4.B4A9
$1N1031: length 3.3
  Top Layer w0.254: U4.A5 11.08,48.49 R5.2
$1N1032: length 3.4
  Top Layer w0.254: U4.B5 10.83,45.49 R6.2
$1N1165: length 5.5
  Top Layer w0.762: D2.2 88,48.22 U10.1
$1N1609: length 2
  Top Layer w0.254: C29.1 40.04,31.06 U8.20
$1N1611: length 3.1
  Top Layer w0.254: U8.10 40.54,37.18 40,37.72 39.66,37.72 C32.2
$4N10210: length 2.4
  Top Layer w0.254: R18.1 40.43,13.72 LED1.2

## Copper pours and planes (outline as drawn; the poured copper is in the pictures)
GND on Top Layer: 0,60.07 100.08,60.07 100.08,-1.4 0,-1.4
GND on Bottom Layer: 0,60.07 101.73,60.07 101.73,-0.13 0,-0.13

## Text on the board
Bottom Silkscreen Layer: + | -
Top Silkscreen Layer: V | C | G | D | 0 | 1 | 上 | 下 | 左 | 右
